# Altium schematic sheet 07.SchDoc
size 297 x 209 mm
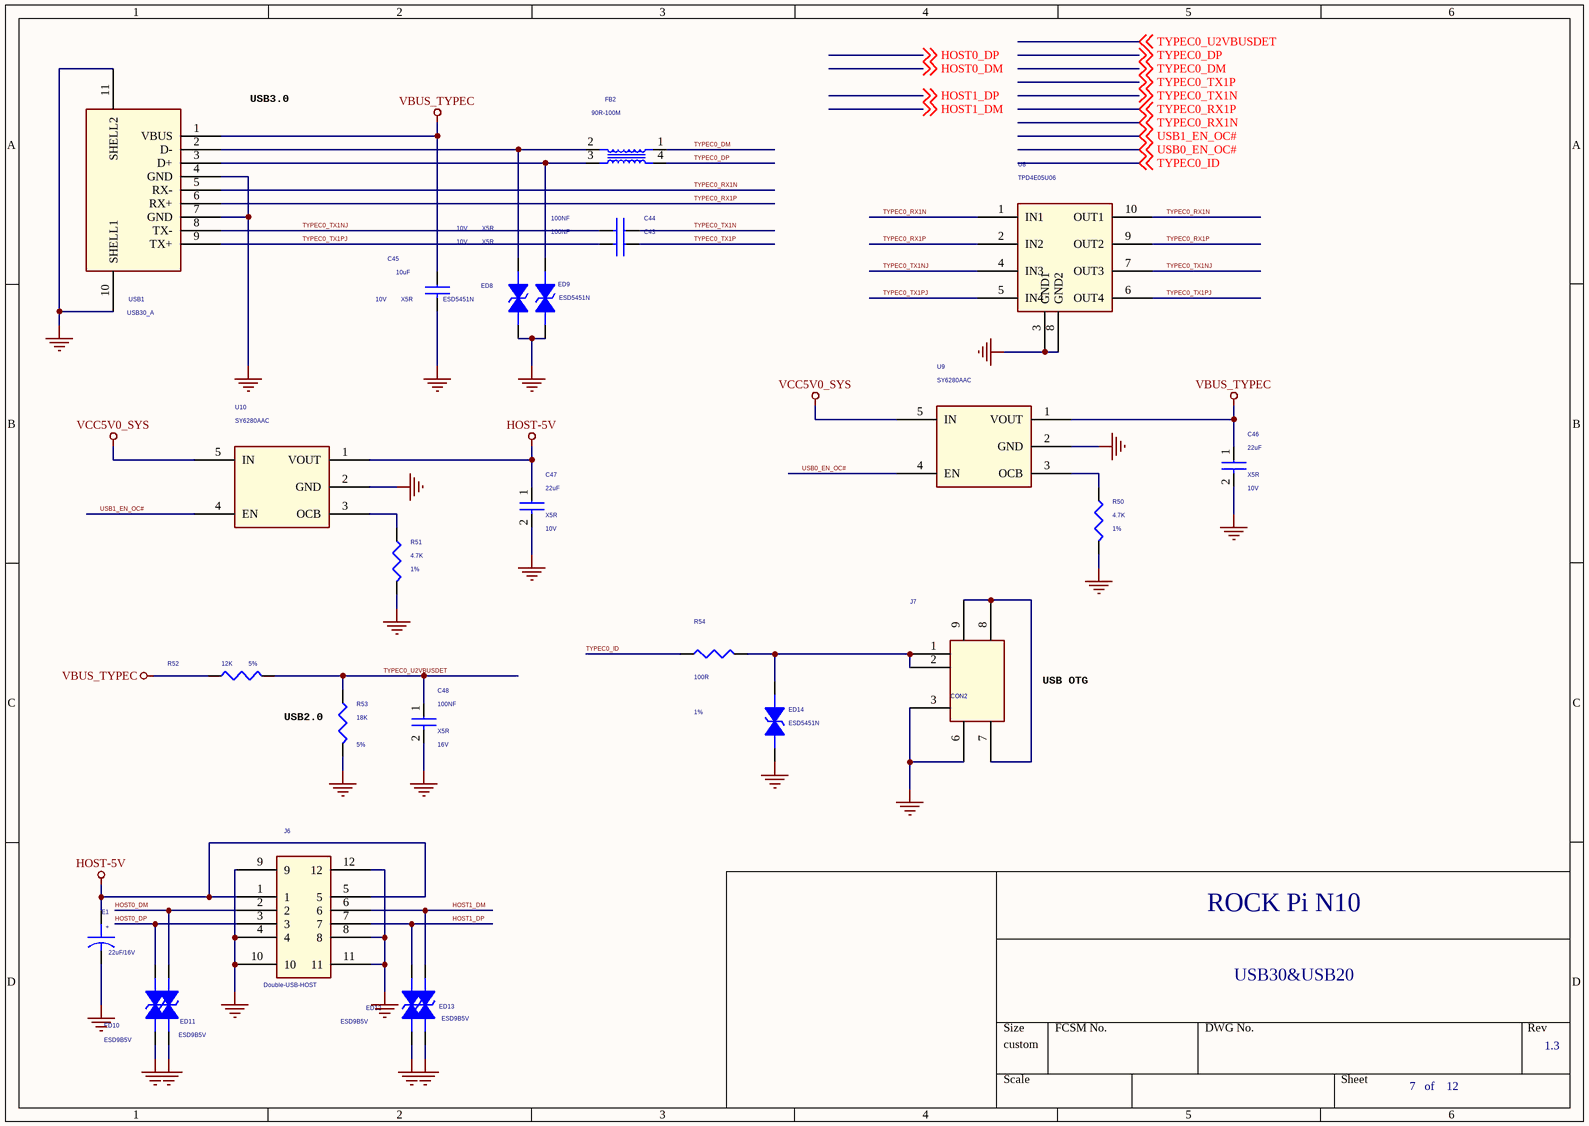
[diagram p0: 07.SchDoc]

## Parts
C43  100NF  Dielectric: X5R  Voltage: 10V  [C0402]
C44  100NF  Dielectric: X5R  Voltage: 10V  [C0402]
C45  10uF  Dielectric: X5R  Voltage: 10V  [C0603]
C46  22uF  Voltage: 10V  Dielectric: X5R  [C0805]
C47  22uF  Voltage: 10V  Dielectric: X5R  [C0805]
C48  100NF  Voltage: 16V  Dielectric: X5R  [C0402]
E1  22uF/16V  [C0805]
ED8  ESD5451N  [E0402N]
ED9  ESD5451N  [E0402N]
ED10  ESD9B5V  [E0402]
ED11  ESD9B5V  [E0402]
ED12  ESD9B5V  [E0402]
ED13  ESD9B5V  [E0402]
ED14  ESD5451N  [E0402N]
FB2  90R-100M  [COMMON-COIL4P]
J6  Double-USB-HOST  [USB_DUAL]
J7  CON2  [LD-020]
R50  4.7K  Tolerance: 1%  [R0402]
R51  4.7K  Tolerance: 1%  [R0402]
R52  12K  Tolerance: 5%  [R0402]
R53  18K  Tolerance: 5%  [R0402]
R54  100R  Tolerance: 1%  [R0402]
U8  TPD4E05U06  [SON10_2R50X1R00X0R50]
U9  SY6280AAC  [SOT25]
U10  SY6280AAC  [SOT25]
USB1  USB30_A  [USB30]

## Nets
GND: C45.2 C46.2 C47.2 C48.2 E1.2 ED8.2 ED9.2 ED10.2 ED11.2 ED12.2 ED13.2 ED14.2 J6.4 J6.8 J6.9 J6.10 J6.11 J6.12 J7.3 J7.6 R50.2 R51.2 R53.2 U8.3(GND1) U8.8(GND2) U9.2(GND) U10.2(GND) USB1.4(GND) USB1.7(GND) USB1.10(SHELL1) USB1.11(SHELL2)
HOST-5V: C47.1 E1.1 J6.1 J6.5 U10.1(VOUT)
VBUS_TYPEC: C45.1 C46.1 R52.1 U9.1(VOUT) USB1.1(VBUS)
VCC5V0_SYS: U9.5(IN) U10.5(IN)
HOST0_DM: ED11.1 J6.2 ; off-sheet HOST0_DM
HOST0_DP: ED10.1 J6.3 ; off-sheet HOST0_DP
HOST1_DM: ED13.1 J6.6 ; off-sheet HOST1_DM
HOST1_DP: ED12.1 J6.7 ; off-sheet HOST1_DP
TYPEC0_DM: FB2.1(R1) ; off-sheet TYPEC0_DM
TYPEC0_DP: FB2.4(R2) ; off-sheet TYPEC0_DP
TYPEC0_ID: R54.1 ; off-sheet TYPEC0_ID
TYPEC0_RX1N: U8.1(IN1) U8.10(OUT1) USB1.5(RX-) ; off-sheet TYPEC0_RX1N
TYPEC0_RX1P: U8.2(IN2) U8.9(OUT2) USB1.6(RX+) ; off-sheet TYPEC0_RX1P
TYPEC0_TX1N: C44.1 ; off-sheet TYPEC0_TX1N
TYPEC0_TX1NJ: C44.2 U8.4(IN3) U8.7(OUT3) USB1.8(TX-)
TYPEC0_TX1P: C43.1 ; off-sheet TYPEC0_TX1P
TYPEC0_TX1PJ: C43.2 U8.5(IN4) U8.6(OUT4) USB1.9(TX+)
TYPEC0_U2VBUSDET: C48.1 R52.2 R53.1 ; off-sheet TYPEC0_U2VBUSDET
USB0_EN_OC#: U9.4(EN) ; off-sheet USB0_EN_OC#
USB1_EN_OC#: U10.4(EN) ; off-sheet USB1_EN_OC#
NetED8_1: ED8.1 FB2.2(R4) USB1.2(D-)
NetED9_1: ED9.1 FB2.3(R3) USB1.3(D+)
NetED14_1: ED14.1 J7.1 J7.2 R54.2
NetJ7_7: J7.7 J7.8 J7.9
NetR50_1: R50.1 U9.3(OCB)
NetR51_1: R51.1 U10.3(OCB)

## Notes on the sheet
- USB3.0
- USB2.0
- (near J7) USB OTG
- ROCK Pi N10
- USB30&USB20
- 1.3
- 7   of    12
- (in symbol CAPACITOR POL) +

## Library data of the parts
C43 = CAP NP_2: cap,100.00nF,+/-10%,10V,X5R,C0201; Manufacturer: TDK; RK PN: C0603X5R1A104K030BC; Priority: A; Tolerance: 10%; Part Type: C0201; Manufacturer PN: C0603X5R1A104K030BC; Created by: JJJ
C44 = CAP NP_2: cap,100.00nF,+/-10%,10V,X5R,C0201; Manufacturer PN: C0603X5R1A104K030BC; Manufacturer: TDK; Tolerance: 10%; Priority: A; Created by: JJJ; Part Type: C0201; RK PN: C0603X5R1A104K030BC
C45 = CAP NP_2: cap,10.00uF,+/-10%,10V,X5R,C0805; Manufacturer: TDK; RK PN: C2012X5R1A106K125AB; Priority: A; Tolerance: 10%; Part Type: C0805; Manufacturer PN: C2012X5R1A106K125AB; Created by: JJJ
C46 C47 = CAP NP_1: cap,10.00uF,+/-10%,10V,X5R,C0805; Manufacturer: TDK; RK PN: C2012X5R1A106K125AB; Priority: A; Tolerance: 10%; Part Type: C0805; Manufacturer PN: C2012X5R1A106K125AB; Created by: JJJ
C48 = CAP NP_1: cap,100.00nF,+/-10%,16V,X5R,C0402; Manufacturer: TDK; RK PN: C1005X5R1C104K050BA; Priority: A; Tolerance: 10%; Part Type: C0402; Manufacturer PN: C1005X5R1C104K050BA; Created by: JJJ
E1 = CAPACITOR POL
ED8 ED9 ED14 = DIODE BI_DIR TRIG_0: 1-Line, Bi-directional, Transient Voltage Suppressors.17.5pF.; Manufacturer: WillSemi(韦尔半导体); Priority: A; RK PN: ESD5451N; Part Type: ESD_TVS; Manufacturer PN: ESD5451N; Created by: JJJ
ED10-ED13 = DIODE_TVS: ESD Component,5V,0.5P,SMD,0402
FB2 = R-PACK4_3
J6 = CON4_1
J7 = CON2_2
R50 R51 = RESISTOR_3: 通用厚膜电阻,4K7,+/-1%,R0402,1/16W.; Manufacturer PN: RC0402FR-074K7L; Manufacturer: YAGEO; Wattage: 1/16W; Priority: A; Created by: YTL; Part Type: 通用厚膜电阻; RK PN: RC0402FR-074K7L
R52 = RESISTOR_3: 通用厚膜电阻,10K,+/-5%,R0402,1/16W.; Manufacturer: YAGEO; RK PN: RC0402JR-0710KL; Priority: A; Wattage: 1/16W; Part Type: 通用厚膜电阻; Manufacturer PN: RC0402JR-0710KL; Created by: YTL
R53 = RESISTOR_3: 通用厚膜电阻,15K,+/-5%,R0402,1/16W.; Manufacturer PN: RC0402JR-0715KL; Manufacturer: YAGEO; Wattage: 1/16W; Priority: A; Created by: YTL; Part Type: 通用厚膜电阻; RK PN: RC0402JR-0715KL
R54 = RESISTOR_3: 通用厚膜电阻,4K7,+/-1%,R0402,1/16W.; Manufacturer: YAGEO; RK PN: RC0402FR-074K7L; Priority: A; Wattage: 1/16W; Part Type: 通用厚膜电阻; Manufacturer PN: RC0402FR-074K7L; Created by: YTL
U8 = ESD_TPD4E05U06: unidirectional ESD protection devices with ultra low capacitance; Manufacturer: TI（德州仪器）; Priority: A; Created by: JJJ; Manufacturer PN: TPD4E05U06; Part Type: ESD_TVS; RK PN: TPD4E05U06
U9 U10 = SWITCH_SY6280: Low Loss Power Distribution Switch; Manufacturer: Silergy（矽力杰）; Priority: A; Created by: JJJ; Manufacturer PN: SY6280AAC; Part Type: Switch; RK PN: SY6280AAC
USB1 = USB30_TYPE_A: A型USB3.0座，卧式，插焊; Manufacturer: 旺科达; Priority: A; RK PN: USB-HOST_30; Created by: JJJ; Manufacturer Part Number: USB30_A; Part Type: USB Jack